# Altium schematic sheet CONN.SchDoc: CONN
size A4; DocumentNumber: 14; Revision: 2.0; SheetNumber: 14; SheetTotal: 18
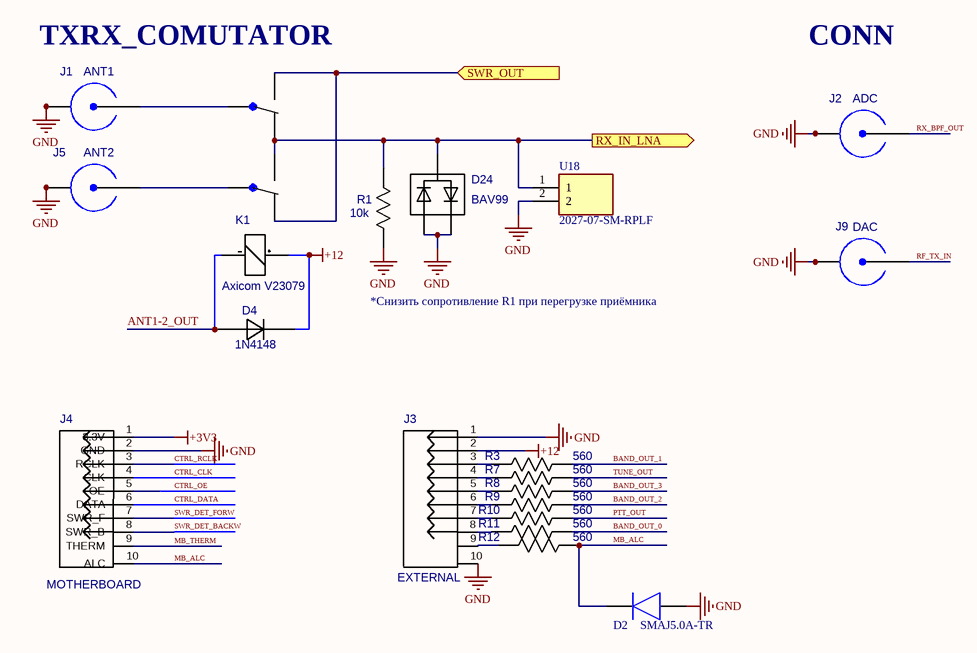
[diagram p0: CONN.SchDoc]

## Parts
D2  SMAJ5.0A-TR  [SMBJ36CATR]
D4  1N4148  [1N4148]
D24  BAV99  [SOT23]
J1  ANT1  [31-5431]
J2  ADC  [31-5431]
J3  EXTERNAL  [90131-0126]
J4  MOTHERBOARD  [90131-0126]
J5  ANT2  [31-5431]
J9  DAC  [31-5431]
K1  Axicom V23079  [V23079]
R1  10k  [RES_1206]
R3  560  [RES_0805]
R7  560  [RES_0805]
R8  560  [RES_0805]
R9  560  [RES_0805]
R10  560  [RES_0805]
R11  560  [RES_0805]
R12  560  [RES_0805]
U18  2027-07-SM-RPLF  [200307SMRPLF]

## Ports
RX_IN_LNA (out), SWR_OUT (in)

## Nets
+3V3: J4.1(3.3V)
+12: D4.1(K) J3.2(12V) K1.1(+)
GND: D2.2(A) D24.1(A(D1)) D24.2(C(D2)) J1.1(GND) J1.2(GND) J1.3(GND) J1.4(GND) J2.1(GND) J2.2(GND) J2.3(GND) J2.4(GND) J3.1(GND) J3.10(GND) J4.2(GND) J5.1(GND) J5.2(GND) J5.3(GND) J5.4(GND) J9.1(GND) J9.2(GND) J9.3(GND) J9.4(GND) R1.1 U18.2
ANT1-2_OUT: D4.2(A) K1.8(-)
BAND_OUT_0: R11.2
BAND_OUT_1: R3.2
BAND_OUT_2: R9.2
BAND_OUT_3: R8.2
CTRL_CLK: J4.4(CLK)
CTRL_DATA: J4.6(DATA)
CTRL_OE: J4.5(OE)
CTRL_RCLK: J4.3(RCLK)
MB_ALC: D2.1(K) J4.10(ALC) R12.2
MB_THERM: J4.9(THERM)
PTT_OUT: R10.2
RF_TX_IN: J9.5(CON)
RX_BPF_OUT: J2.5(CON)
RX_IN_LNA: D24.3(C(D1),A(D2)) K1.4(S) K1.7(O) R1.2 U18.1 ; port RX_IN_LNA
SWR_DET_BACKW: J4.8(SWR_B)
SWR_DET_FORW: J4.7(SWR_F)
SWR_OUT: K1.2(O) K1.5(S) ; port SWR_OUT
TUNE_OUT: R7.2
NetJ1_5: J1.5(CON) K1.6(P)
NetJ3_3: J3.3(BAND1) R3.1
NetJ3_4: J3.4(TUNE_OUT) R7.1
NetJ3_5: J3.5(BAND3) R8.1
NetJ3_6: J3.6(BAND2) R9.1
NetJ3_7: J3.7(PTT_OUT) R10.1
NetJ3_8: J3.8(BAND0) R11.1
NetJ3_9: J3.9(ALC_IN) R12.1
NetJ5_5: J5.5(CON) K1.3(P)

## Notes on the sheet
- TXRX_COMUTATOR
- CONN
- *Снизить сопротивление R1 при перегрузке приёмника
- Title
- Size:
- Date:
- A4
- Number:
- Time:
- Revision:
- Sheet
- of
- File:

## Library data of the parts
D2 = SMLVT3V3: Diode; Manufacturer_Name: STMicroelectronics; Allied_Number: 70013736; Datasheet Link: http://www.st.com/web/en/resource/technical/document/datasheet/CD00000923.pdf; Height: 2.65mm; Manufacturer_Part_Number: SMLVT3V3; Mouser Part Number: 511-SMLVT3V3; Mouser Price/Stock: https://www.mouser.com/Search/Refine.aspx?Keyword=511-SMLVT3V3; RS Part Number: 5444821P; RS Price/Stock: http://uk.rs-online.com/web/p/products/5444821P; Allied Price/Stock: http://www.alliedelec.com/stmicroelectronics-smlvt3v3/70013736/
J1 J2 J5 J9 = 31-5431: SMA
  J1: Value: ANT1
  J2: Value: ADC
  J5: Value: ANT2
  J9: Value: DAC
J3 J4 = 90131-0126: 2*5 PIN; Value: *
R1 = RES_1206
R3 R7-R12 = RES_0805: Value: 560
U18 = 2003-07-SM-RPLF: Manufacturer_Name: Bourns; Datasheet Link: https://www.arrow.com/en/products/2003-07-sm-rplf/bourns; Height: 3.7mm; Manufacturer_Part_Number: 2003-07-SM-RPLF; Mouser Part Number: 652-2003-07-SM-RPLF; Mouser Price/Stock: https://www.mouser.co.uk/ProductDetail/Bourns/2003-07-SM-RPLF?qs=j%252B1pi9TdxUaYVLyv%2F6mAaA%3D%3D; Arrow Part Number: 2003-07-SM-RPLF; Arrow Price/Stock: https://www.arrow.com/en/products/2003-07-sm-rplf/bourns
D4 = 1N4148: Value: 1N4148
D24 = BAV99: Value: BAV99
K1 = Axicom V23079: Value: *